# Altium schematic sheet 系统方案1.SchDoc
size A4; SheetNumber: 2; SheetTotal: 2
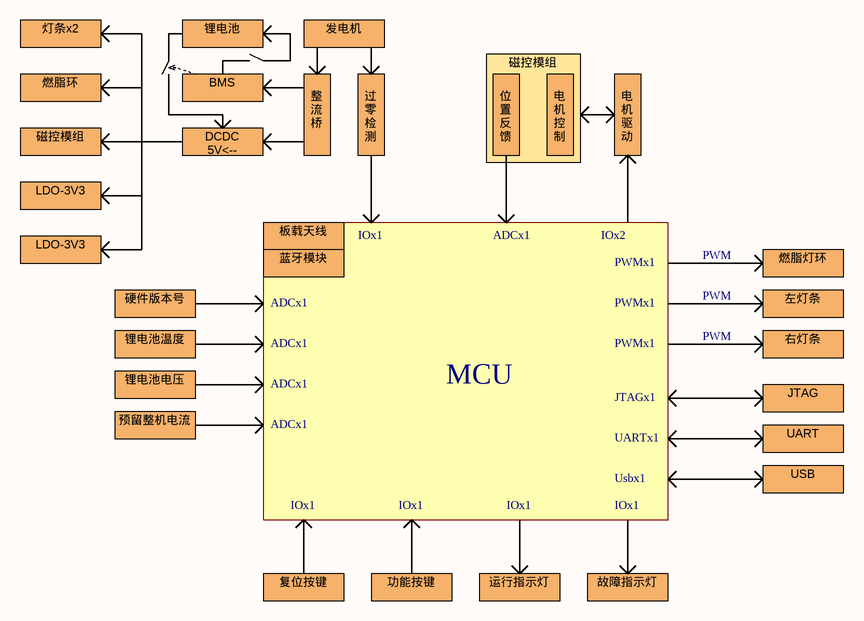
[diagram p0: 系统方案1.SchDoc]

## Notes on the sheet
- 灯条x2
- 锂电池
- 发电机
- 磁控模组
- 燃脂环
- DCDC
  5V<--
- BMS
- 整
  流
  桥
- 过
  零
  检
  测
- 位
  置
  反
  馈
- 电
  机
  控
  制
- 电
  机
  驱
  动
- LDO-3V3
- 板载天线
- 蓝牙模块
- IOx1
- ADCx1
- IOx2
- PWMx1
- PWM
- 燃脂灯环
- 硬件版本号
- 锂电池温度
- 左灯条
- 右灯条
- 锂电池电压
- MCU
- JTAGx1
- JTAG
- 预留整机电流
- UARTx1
- Usbx1
- UART
- USB
- 复位按键
- 功能按键
- 运行指示灯
- 故障指示灯